# EAGLE design Attenuation (EAGLE 9.6.2)
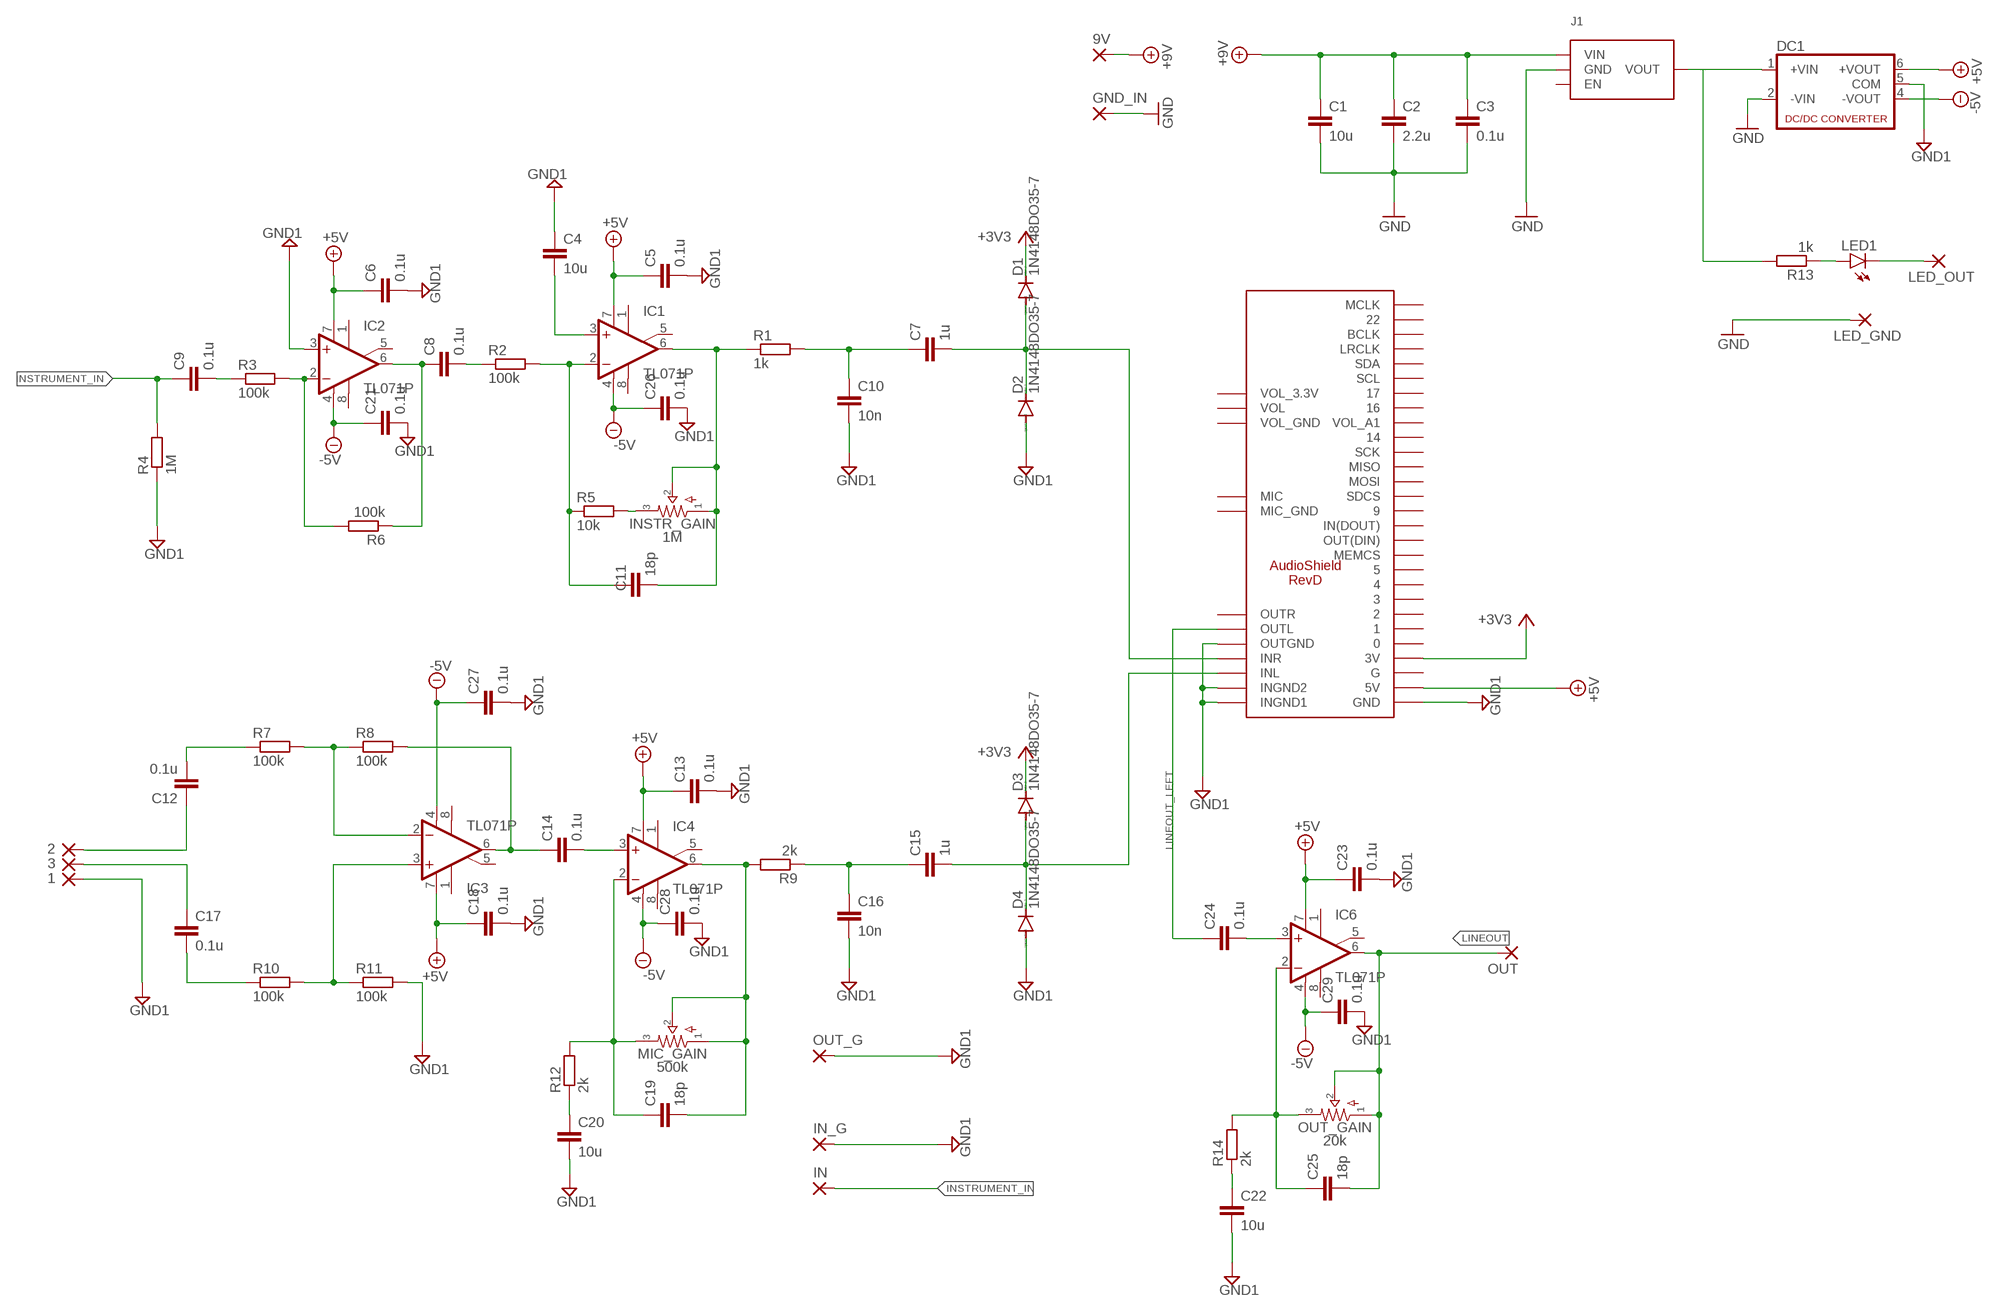
[diagram p0: schematic, sheet 1]

## Parts
1  1,6/0,8  [1,6/0,8]
2  1,6/0,8  [1,6/0,8]
3  1,6/0,8  [1,6/0,8]
9V  1,6/0,8  [1,6/0,8]
C1  10u  C5/2.5  [C5B2.5]
C2  2.2u  C5/2.5  [C5B2.5]
C3  0.1u  C-EUC0805  [C0805]
C4  10u  C5/2.5  [C5B2.5]
C5  0.1u  C-EUC0805  [C0805]
C6  0.1u  C-EUC0805  [C0805]
C7  1u  C-EUC0805  [C0805]
C8  0.1u  C-EUC0805  [C0805]
C9  0.1u  C-EUC0805  [C0805]
C10  10n  C-EUC0805  [C0805]
C11  18p  C-EUC0805  [C0805]
C12  0.1u  C-EUC0805  [C0805]
C13  0.1u  C-EUC0805  [C0805]
C14  0.1u  C-EUC0805  [C0805]
C15  1u  C-EUC0805  [C0805]
C16  10n  C-EUC0805  [C0805]
C17  0.1u  C-EUC0805  [C0805]
C18  0.1u  C-EUC0805  [C0805]
C19  18p  C-EUC0805  [C0805]
C20  10u  C5/2.5  [C5B2.5]
C21  0.1u  C-EUC0805  [C0805]
C22  10u  C5/2.5  [C5B2.5]
C23  0.1u  C-EUC0805  [C0805]
C24  0.1u  C-EUC0805  [C0805]
C25  18p  C-EUC0805  [C0805]
C26  0.1u  C-EUC0805  [C0805]
C27  0.1u  C-EUC0805  [C0805]
C28  0.1u  C-EUC0805  [C0805]
C29  0.1u  C-EUC0805  [C0805]
D1  1N4148DO35-7  [DO35-7]
D2  1N4148DO35-7  [DO35-7]
D3  1N4148DO35-7  [DO35-7]
D4  1N4148DO35-7  [DO35-7]
DC1  NMA  [NMA]
GND_IN  1,6/0,8  [1,6/0,8]
IC1  TL071P  [DIL08]
IC2  TL071P  [DIL08]
IC3  TL071P  [DIL08]
IC4  TL071P  [DIL08]
IC6  TL071P  [DIL08]
IN  1,6/0,8  [1,6/0,8]
IN_G  1,6/0,8  [1,6/0,8]
INSTR_GAIN  1M  16MM.4  [16MM_PADS.1]
J1  DCDC_MINI_CONVERTER  [DCDC_MINI_CONVERTER]
LED1  LED5MM  [LED5MM]
LED_GND  1,6/0,8  [1,6/0,8]
LED_OUT  1,6/0,8  [1,6/0,8]
MIC_GAIN  500k  16MM.4  [16MM_PADS.1]
MOD1  AUDIOSHIELD-REVD  [AUDIOSHIELD-REVD]
OUT  1,6/0,8  [1,6/0,8]
OUT_G  1,6/0,8  [1,6/0,8]
OUT_GAIN  20k  16MM.4  [16MM_PADS.1]
R1  1k  R-EU_R0805  [R0805]
R2  100k  R-EU_R0805  [R0805]
R3  100k  R-EU_R0805  [R0805]
R4  1M  R-EU_R0805  [R0805]
R5  10k  R-EU_R0805  [R0805]
R6  100k  R-EU_R0805  [R0805]
R7  100k  R-EU_R0805  [R0805]
R8  100k  R-EU_R0805  [R0805]
R9  2k  R-EU_R0805  [R0805]
R10  100k  R-EU_R0805  [R0805]
R11  100k  R-EU_R0805  [R0805]
R12  2k  R-EU_R0805  [R0805]
R13  1k  R-EU_R0805  [R0805]
R14  2k  R-EU_R0805  [R0805]

## Nets
+3V3: D1.C D3.C MOD1.3V
+5V: C5.1 C6.1 C13.1 C18.1 C23.1 DC1.6(+VOUT) IC1.7(V+) IC2.7(V+) IC3.7(V+) IC4.7(V+) IC6.7(V+) MOD1.5V
+9V: 9V.1(P) C1.1 C2.1 C3.1 J1.VIN
-5V: C21.1 C26.1 C27.1 C28.1 C29.1 DC1.4(-VOUT) IC1.4(V-) IC2.4(V-) IC3.4(V-) IC4.4(V-) IC6.4(V-)
GND: C1.2 C2.2 C3.2 DC1.2(-VIN) GND_IN.1(P) J1.GND LED_GND.1(P)
GND1: 1.1(P) C4.1 C5.2 C6.2 C10.2 C13.2 C16.2 C18.2 C20.2 C21.2 C22.2 C23.2 C26.2 C27.2 C28.2 C29.2 D2.A D4.A DC1.5(COM) IC2.3(+IN) IN_G.1(P) MOD1.GND MOD1.INGND1 MOD1.INGND2 MOD1.OUTGND OUT_G.1(P) R4.1 R11.2
INSTRUMENT_IN: C9.1 IN.1(P) R4.2
LINEOUT: C25.2 IC6.6(OUT) OUT.1(P) OUT_GAIN.1 OUT_GAIN.2
LINEOUT_LEFT: C24.1 MOD1.OUTL
N$1: LED1.A R13.1
N$2: C11.1 IC1.2(-IN) R2.2 R5.1
N$3: C7.1 C10.1 R1.2
N$4: C4.2 IC1.3(+IN)
N$5: LED1.K(C) LED_OUT.1(P)
N$6: C11.2 IC1.6(OUT) INSTR_GAIN.1 INSTR_GAIN.2 R1.1
N$7: C7.2 D1.A D2.C MOD1.INR
N$8: 2.1(P) C12.1
N$9: C12.2 R7.1
N$10: DC1.1(+VIN) J1.VOUT R13.2
N$11: 3.1(P) C17.1
N$12: C17.2 R10.1
N$14: C14.1 IC3.6(OUT) R8.2
N$15: C25.1 IC6.2(-IN) OUT_GAIN.3 R14.2
N$16: C22.1 R14.1
N$18: C24.2 IC6.3(+IN)
N$20: C19.1 IC4.2(-IN) MIC_GAIN.3 R12.2
N$22: C20.1 R12.1
N$23: C19.2 IC4.6(OUT) MIC_GAIN.1 MIC_GAIN.2 R9.2
N$24: C15.1 C16.1 R9.1
N$25: C15.2 D3.A D4.C MOD1.INL
N$30: C8.1 IC2.6(OUT) R6.1
N$31: C9.2 R3.1
N$32: C8.2 R2.1
N$33: INSTR_GAIN.3 R5.2
N$34: IC2.2(-IN) R3.2 R6.2
N$35: IC3.3(+IN) R10.2 R11.1
N$36: IC3.2(-IN) R7.2 R8.1
N$38: C14.2 IC4.3(+IN)
Unconnected: IC1.1(ON1) IC1.5(ON2) IC1.8(OPT) IC2.1(ON1) IC2.5(ON2) IC2.8(OPT) IC3.1(ON1) IC3.5(ON2) IC3.8(OPT) IC4.1(ON1) IC4.5(ON2) IC4.8(OPT) IC6.1(ON1) IC6.5(ON2) IC6.8(OPT) J1.EN MOD1.0 MOD1.1 MOD1.2 MOD1.3 MOD1.4 MOD1.5 MOD1.6(MEMCS) MOD1.7(OUT(DIN)) MOD1.8(IN(DOUT)) MOD1.9 MOD1.10(SDCS) MOD1.11(MOSI) MOD1.12(MISO) MOD1.13(SCK) MOD1.14 MOD1.15(VOL_A1) MOD1.16 MOD1.17 MOD1.18(SDA) MOD1.19(SCL) MOD1.20(LRCLK) MOD1.21(BCLK) MOD1.22 MOD1.23(MCLK) MOD1.G MOD1.GND_MIC(MIC_GND) MOD1.MIC MOD1.OUTR MOD1.VOL MOD1.VOL_3.3V MOD1.VOL_GND

## Library data of the parts
1-3 9V GND_IN IN IN_G LED_GND LED_OUT OUT OUT_G = wirepad:1,6/0,8: THROUGH-HOLE PAD
C1 C2 C4 C20 C22 = capacitor-wima:C: CAPACITOR naming: grid - package width
C3 C5-C19 C21 C23-C29 = rcl:C-EU: CAPACITOR, European symbol; SPICEPREFIX: C
D1-D4 = diode:1N4148: DIODE high speed (Philips)
DC1 = dc-dc-converter:NMA: DC-DC CONVERTER; MF: C & D TECHNOLOGIES, INC; MPN: NMA0515SC; OC_FARNELL: 1021434; OC_NEWARK: 61K3064
IC1-IC4 IC6 = linear:TL071: OP AMP
INSTR_GAIN MIC_GAIN OUT_GAIN = potentiometers:16MM: 16mm Poteniometers
J1 = Joel Custom library:DCDC_MINI_CONVERTER: Mini DC-DC buck converter
LED1 = led:LED: LED OSRAM: - CHIPLED LG R971, LG N971, LY N971, LG Q971, LY Q971, LO R971, LY R971 LH N974, LH R974 LS Q976, LO Q976, LY Q976 LO Q996 - Hyper CHIPLED LW Q18S LB Q993, LB Q99A, LB R99A - SideLED LS A670, LO A670, LY A670, LG A670, LP A670 LB A673, LV A673, LT A673, LW A673 LH A674 LY A675 LS A676, LA A676, LO A676, LY A676, LW A676 LS A679, LY A679, LG A679 - Hyper Micro SIDELED® LS Y876, LA Y876, LO Y876, LY Y876 LT Y87S - SmartLED LW L88C, LW L88S LB L89C, LB L89S, LG L890 LS L89K, LO L89K, LY L89K LS L896, LA L896, LO L896, LY L896 - TOPLED LS T670, LO T670, LY T670, LG T670, LP T670 LSG T670, LSP T670, LSY T670, LOP T670, LYG T670 LG T671, LOG T671, LSG T671 LB T673, LV T673, LT T673, LW T673 LH T674 LS T676, LA T676, LO T676, LY T676, LB T676, LH T676, LSB T676, LW T676 LB T67C, LV T67C, LT T67C, LS T67K, LO T67K, LY T67K, LW E67C LS E67B, LA E67B, LO E67B, LY E67B, LB E67C, LV E67C, LT E67C LW T67C LS T679, LY T679, LG T679 LS T770, LO T770, LY T770, LG T770, LP T770 LB T773, LV T773, LT T773, LW T773 LH T774 LS E675, LA E675, LY E675, LS T675 LS T776, LA T776, LO T776, LY T776, LB T776 LHGB T686 LT T68C, LB T68C - Hyper Mini TOPLED® LB M676 - Mini TOPLED Santana® LG M470 LS M47K, LO M47K, LY M47K Source: http://www.osram.convergy.de LUXEON: - LUMILED® LXK2-PW12-R00, LXK2-PW12-S00, LXK2-PW14-U00, LXK2-PW14-V00 LXK2-PM12-R00, LXK2-PM12-S00, LXK2-PM14-U00 LXK2-PE12-Q00, LXK2-PE12-R00, LXK2-PE12-S00, LXK2-PE14-T00, LXK2-PE14-U00 LXK2-PB12-K00, LXK2-PB12-L00, LXK2-PB12-M00, LXK2-PB14-N00, LXK2-PB14-P00, LXK2-PB14-Q00 LXK2-PR12-L00, LXK2-PR12-M00, LXK2-PR14-Q00, LXK2-PR14-R00 LXK2-PD12-Q00, LXK2-PD12-R00, LXK2-PD12-S00 LXK2-PH12-R00, LXK2-PH12-S00 LXK2-PL12-P00, LXK2-PL12-Q00, LXK2-PL12-R00 Source: www.luxeon.com KINGBRIGHT: KA-3528ASYC Source: www.kingbright.com
MOD1 = Teensy_Audioshield:AUDIOSHIELD-REVD
R1-R14 = rcl:R-EU_: RESISTOR, European symbol; SPICEPREFIX: R

## Board
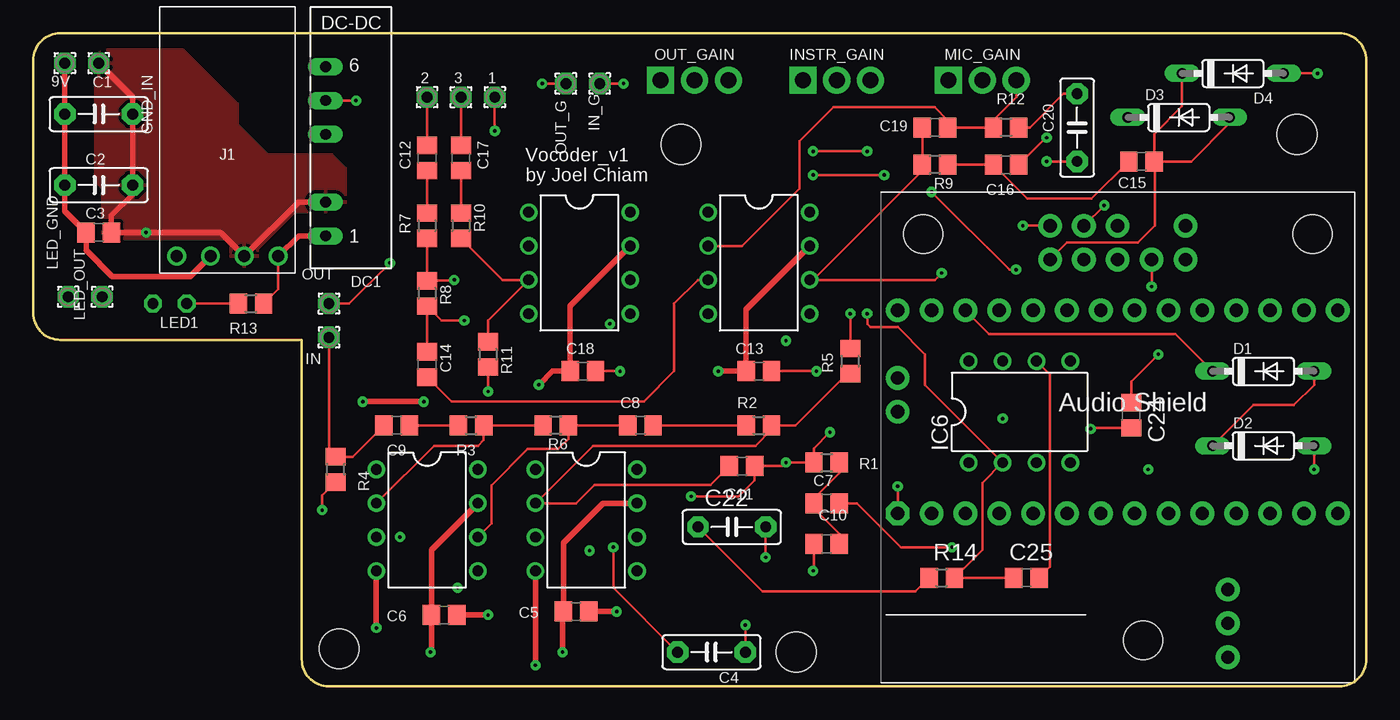
[diagram p1: board, top side]
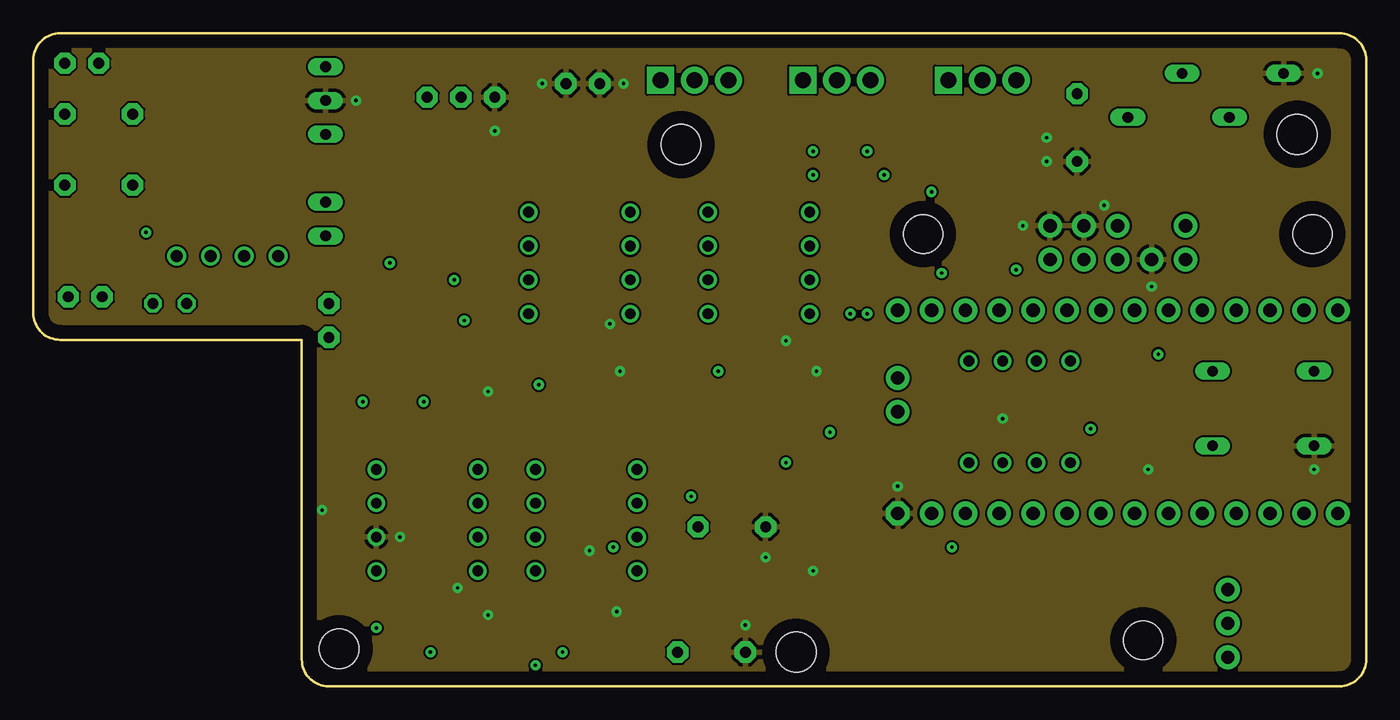
[diagram p2: board, inner layer GND]
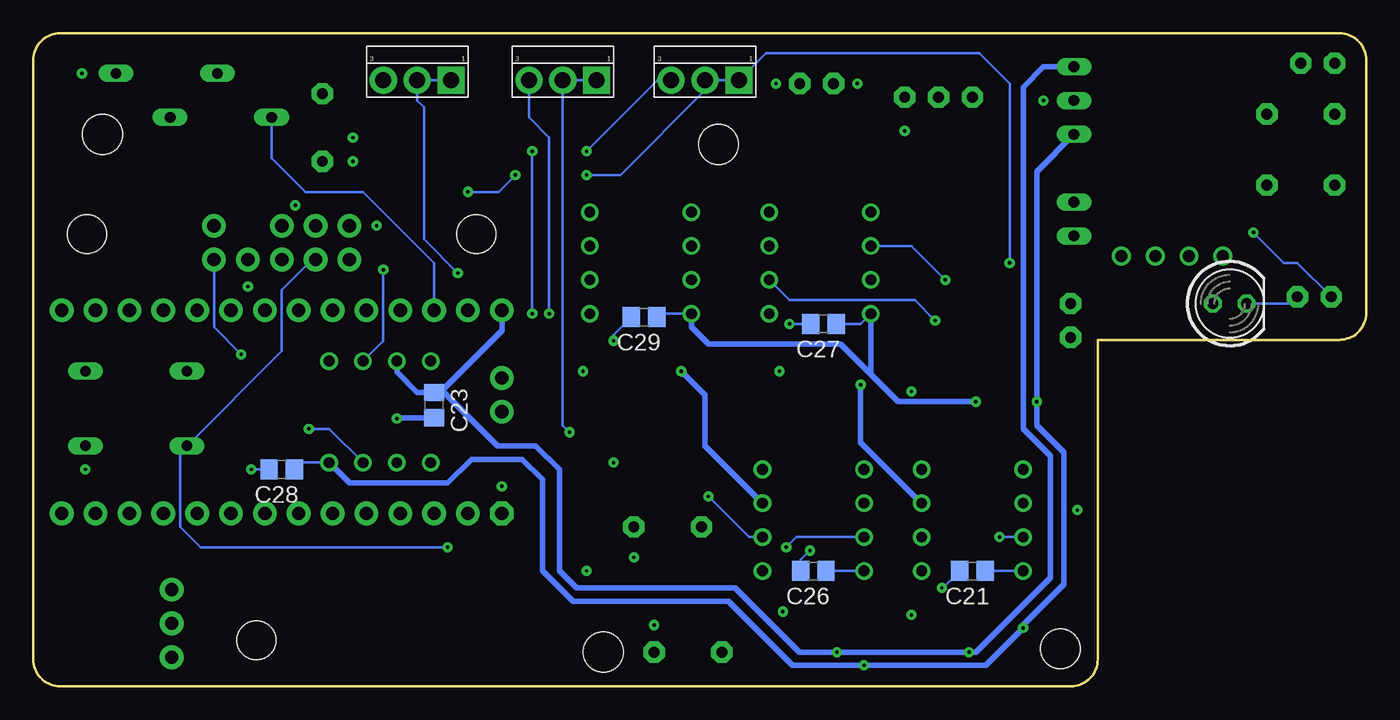
[diagram p3: board, bottom side, seen from below]

Size 100 x 49 mm. Coordinates in mm from the lower left corner, seen from the top.
Outline: 100,2 100,47 arc90 98,49 2,49 arc90 0,47 0,28 arc90 2,26 20.15,26 20.15,2 arc90 22.15,0 98,0 arc90 100,2
Copper layers (1+2*15+16): Top 0.035mm / dielectric 0.11mm / GND 0.035mm / dielectric 1.2mm / Trace2 0.035mm / dielectric 0.11mm / Bottom 0.035mm
Design rules "default *": minimum track width 6mil, minimum drill 0.25mm, track to track 6mil, track to pad 6mil, pad to pad 6mil, via to via 6mil, smd to smd 6mil, copper to edge 40mil, drill to drill 6mil, minimum pad ring 10mil, minimum via ring 10mil, stop-mask expansion 4mil, vias tented up to drill 0mil, thermal gap 10mil
Holes 3 mm at 48.59,40.66 22.94,2.81 57.23,2.56 94.82,41.42

### Footprints (pad centres in the part's own frame; a part is rotated, then mirrored left to right if it is on the bottom)
1,6/0,8 = drill 0.813 pad 1.6 octagon: 1 0,0
C5B2.5 = drill 0.813 pad 1.6 octagon: 1 -2.54,0; 2 2.54,0
C0805 = smd 1.3 x 1.5: 1 -0.95,0; 2 0.95,0
DO35-7 = drill 0.813 long: A 3.81,0; C -3.81,0
NMA = drill 0.813 long: 1 0,6.35; 2 0,3.81; 4 0,-1.27; 5 0,-3.81; 6 0,-6.35
DIL08 = drill 0.813 pad 1.27: 1 -3.81,-3.81; 2 -1.27,-3.81; 3 1.27,-3.81; 4 3.81,-3.81; 5 3.81,3.81; 6 1.27,3.81; 7 -1.27,3.81; 8 -3.81,3.81
16MM_PADS.1 = drill 1.2 pad 2.032 square: 1 2.54,0 | drill 1.2 pad 2.032: 2 0,0; 3 -2.54,0
DCDC_MINI_CONVERTER = drill 0.9: EN 3.81,0; GND -1.27,0; VIN 1.27,0; VOUT -3.81,0
LED5MM = drill 0.813 octagon: A -1.27,0; K 1.27,0
AUDIOSHIELD-REVD = drill 1 pad 1.778: 0 -13.97,-5.08; 1 -11.43,-5.08; 2 -8.89,-5.08; 3 -6.35,-5.08; 3V -11.43,10.16; 4 -3.81,-5.08; 5 -1.27,-5.08; 5V -16.51,10.16; 6 1.27,-5.08; 7 3.81,-5.08; 8 6.35,-5.08; 9 8.89,-5.08; 10 11.43,-5.08; 11 13.97,-5.08; 12 16.51,-5.08; 13 16.51,10.16; 14 13.97,10.16; 15 11.43,10.16; 16 8.89,10.16; 17 6.35,10.16; 18 3.81,10.16; 19 1.27,10.16; 20 -1.27,10.16; 21 -3.81,10.16; 22 -6.35,10.16; 23 -8.89,10.16; G -13.97,10.16; GND_MIC -16.51,2.54; INGND1 -5.08,16.51; INGND2 -2.54,16.51; INL -5.08,13.97; INR -2.54,13.97; MIC -16.51,5.08; OUTGND 2.54,13.97; OUTL 5.08,13.97; OUTR 0,13.97; UNUSED1 0,16.51; UNUSED2 5.08,16.51; VOL 8.255,-13.335; VOL_3.3V 8.255,-15.875; VOL_GND 8.255,-10.795 | drill 1 pad 1.778 octagon: GND -16.51,-5.08 | hole 2.921: 1.905,-14.605; -14.605,15.875; 14.605,15.875
R0805 = smd 1.3 x 1.5: 1 -0.95,0; 2 0.95,0

### Placement (x,y rotation side)
1  34.62,44.21 0 top
2  29.54,44.21 0 top
3  32.08,44.21 180 top
9V  2.37,46.75 0 top
C1  4.91,42.94 0 top
C2  4.91,37.61 0 top
C3  4.91,34.05 0 top
C4  50.88,2.56 180 top
C5  40.72,5.6 0 top
C6  30.81,5.35 0 top
C7  59.52,13.73 0 top
C8  45.55,19.57 0 top
C9  27.26,19.57 0 top
C10  59.52,10.68 180 top
C11  53.17,16.53 0 top
C12  29.54,39.64 270 top
C13  54.44,23.64 0 top
C14  29.54,24.15 270 top
C15  83.14,39.39 0 top
C16  72.98,39.13 0 top
C17  32.08,39.64 270 top
C18  41.23,23.64 0 top
C19  67.64,41.93 180 top
C20  78.31,41.93 270 top
C21  29.54,8.65 180 bottom
C22  52.4,11.95 0 top
C23  69.93,21.1 270 bottom
C24  82.38,20.34 270 top
C25  74.5,8.14 0 top
C26  41.48,8.65 180 bottom
C27  40.72,27.19 180 bottom
C28  81.36,16.27 180 bottom
C29  54.18,27.7 180 bottom
D1  92.28,23.64 0 top
D2  92.28,18.05 0 top
D3  85.93,42.69 0 top
D4  90,45.99 0 top
DC1  21.92,40.15 180 top
GND_IN  4.91,46.75 0 top
IC1  41.48,12.46 270 top
IC2  29.54,12.46 270 top
IC3  40.97,31.77 270 top
IC4  54.44,31.77 270 top
IC6  73.99,20.59 0 top
IN  22.18,26.18 0 top
IN_G  42.5,45.23 270 top
INSTR_GAIN  60.28,45.48 0 bottom
J1  14.56,32.27 180 top
LED1  10.24,28.72 0 bottom
LED_GND  2.62,29.23 0 top
LED_OUT  5.16,29.23 0 top
MIC_GAIN  71.2,45.48 0 bottom
MOD1  81.36,18.05 0 top
OUT  22.18,28.72 90 top
OUT_G  39.96,45.23 270 top
OUT_GAIN  49.61,45.48 0 bottom
R1  59.52,16.78 0 top
R2  54.44,19.57 0 top
R3  32.85,19.57 0 top
R4  22.69,16.27 90 top
R5  61.29,24.4 90 top
R6  39.2,19.57 180 top
R7  29.54,34.56 270 top
R8  29.54,29.48 270 top
R9  67.64,39.13 180 top
R10  32.08,34.56 270 top
R11  34.12,24.91 270 top
R12  72.98,41.93 180 top
R13  16.34,28.72 0 top
R14  68.15,8.14 0 top

### Tracks (layer width: path | path; a pad name or v marks a point on that pad's centre or on a via)
+3V3
  Top 0.203: MOD1.3V 71.71,26.43 85.68,26.43 D1.C
  Bottom 0.203: MOD1.3V 69.93,31.77 75.26,37.1 79.58,37.1 82.12,39.64 D3.C
+5V  (via drill 0.25)
  Top 0.406: IC2.7 29.86,10.24 C6.1 29.86,2.62 v29.8,2.56 | v39.7,2.56 39.7,5.54 C5.1 39.77,10.75 42.75,13.73 IC1.7 | v37.93,22.62 38.94,23.64 C18.1 40.28,28.53 IC3.7 | IC4.7 53.49,28.28 C13.1 v51.39,23.64
  Bottom 0.406: DC1.6 24.21,46.5 25.73,44.97 25.73,19.32 23.7,17.29 23.7,8.14 29.29,2.56 v29.8,2.56 v39.7,2.56 42.52,2.56 47.35,7.38 59.26,7.38 60.53,8.65 60.53,16.27 62.31,18.05 65.17,18.05 69.17,22.05 C23.1 | IC2.7 37.93,18.3 v37.93,22.62 | IC1.7 49.61,18.05 49.61,21.86 v51.39,23.64 | C23.1 71.2,22.05 72.72,23.57 IC6.7 | C23.1 69.49,22.05 64.85,26.69 MOD1.5V
+9V
  Top 0.406: 9V.1 C1.1 C2.1 2.37,35.64 C3.1 3.96,32.72 5.92,30.75 11.76,30.75 J1.VIN
-5V  (via drill 0.25)
  Top 0.406: IC2.4 v25.73,4.37 | IC1.4 v37.67,1.58 | v24.72,21.35 v29.29,21.35
  Bottom 0.203: IC6.4 79.9,16.78 C28.1 | IC4.4 52.98,27.96 C29.1 | C27.1 37.93,27.19 IC3.4 | C26.1 IC1.4 | C21.1 IC2.4
  Bottom 0.406: DC1.4 24.72,38.62 v24.72,21.35 24.72,19.57 22.69,17.54 22.69,7.64 25.73,4.59 v25.73,4.37 28.53,1.58 v37.67,1.58 43.04,1.58 47.83,6.37 59.52,6.37 61.8,8.65 61.8,15.51 63.33,17.03 67.14,17.03 68.91,15.26 76.28,15.26 IC6.4 | v29.29,21.35 35.13,21.35 37.16,23.38 | 37.16,23.38 IC3.4 | IC4.4 50.63,26.94 49.36,25.67 39.45,25.67 37.16,23.38
GND  (via drill 0.25)
  Top 0.406: GND_IN.1 7.45,44.21 C1.2 C2.2 7.45,36.91 5.86,35.32 C3.2 v8.46,34.05 14.05,34.05 J1.GND 19.89,36.34 DC1.2
  Bottom 0.203: LED_GND.1 5.16,31.77 6.18,31.77 v8.46,34.05
  pour Top: 5.16,33.8 5.41,33.54 14.3,33.54 14.81,33.04 14.81,31.77 15.07,31.51 16.59,31.51 16.84,31.77 16.84,32.78 19.64,35.58 22.94,35.58 23.45,36.08 23.45,38.88 22.43,39.89 17.61,39.89 15.32,42.18 15.32,43.7 11,48.02 5.41,48.02 4.65,47.26 4.65,37.86 5.16,37.35
GND1  (via drill 0.25)
  Top 0.203: DC1.5 v24.21,43.96 | MOD1.GND v64.85,15 | D2.A v96.09,16.27 | 1.1 v34.62,41.67 | OUT_G.1 v38.18,45.23 | R4.1 21.67,14.31 v21.67,13.22 | v44.02,23.64 C18.2 | R11.2 v34.12,22.11 | C13.2 v58.75,23.64 | D4.A v96.35,45.99 | v58.5,8.65 58.57,8.72 C10.2 | v76.03,41.16 75.96,41.16 C16.2 | C20.2 v76.03,39.39 | MOD1.OUTGND v83.9,29.99 | MOD1.INGND1 v74.25,34.56 | MOD1.INGND2 v80.34,36.08 | IN_G.1 v44.28,45.23 | C4.1 v53.42,4.59 | C22.2 v54.94,9.67
  Top 0.406: v34.12,5.35 C6.2 | C5.2 v43.77,5.6
  Bottom 0.203: IC2.3 v27.51,11.19 | C28.2 v83.65,16.27 | C21.2 31.76,7.38 v31.83,7.38 | C26.2 42.43,9.48 v41.74,10.18 | C27.2 v43.26,27.19 | C29.2 56.47,26.37 v56.47,25.92
  Bottom 0.406: C23.2 72.66,20.15 v72.72,20.08
  pour GND: -0.43,49.8 -0.43,-1.76 100.66,-1.76 100.66,49.8
INSTRUMENT_IN
  Top 0.203: IN.1 22.18,17.73 R4.2 23.96,17.22 C9.1
LINEOUT  (via drill 0.25)
  Top 0.203: IC6.6 76.28,23.38 76.28,8.97 C25.2 | v26.75,31.77 23.7,28.72 OUT.1 | v73.74,31.26 73.23,31.26 v67.39,37.1 | v63.83,38.37 v58.5,38.37
  Bottom 0.203: IC6.6 73.74,25.92 v73.74,31.26 | v26.75,31.77 26.75,45.23 29.04,47.51 45.04,47.51 OUT_GAIN.1 OUT_GAIN.2 49.61,44.72 55.96,38.37 v58.5,38.37 | v67.39,37.1 65.1,37.1 v63.83,38.37
LINEOUT_LEFT  (via drill 0.25)
  Top 0.203: C24.1 82.38,22.88 v84.41,24.91
  Bottom 0.203: v84.41,24.91 86.44,26.94 MOD1.OUTL
N$1
  Top 0.203: R13.1 LED1.A
N$2
  Top 0.203: R5.1 61.04,23.45 57.16,19.57 R2.2 55.39,19.25 54.18,18.05 41.99,18.05 IC1.2 40.72,13.73 42.09,15.1 50.79,15.1 C11.1
N$3
  Top 0.203: C10.1 60.47,11.45 58.57,13.35 C7.1 58.37,13.93 60.47,16.02 R1.2
N$4  (via drill 0.25)
  Top 0.203: C4.2 43.51,7.38 v43.51,10.43
  Bottom 0.203: v43.51,10.43 42.75,11.19 IC1.3
N$5
  Bottom 0.203: LED_OUT.1 5.67,28.72 LED1.K
N$6  (via drill 0.25)
  Top 0.203: v59.77,19.07 58.57,17.86 R1.1 v56.47,16.78 56.21,16.53 C11.2 54.12,15.44 52.91,14.24 v49.36,14.24
  Bottom 0.203: v59.77,19.07 60.28,19.57 INSTR_GAIN.2 INSTR_GAIN.1 | v49.36,14.24 46.31,11.19 IC1.6
N$7  (via drill 0.25)
  Top 0.203: D2.C 91.52,21.1 94.57,21.1 96.09,22.62 D1.A | C7.2 61.8,13.73 65.1,10.43 v68.91,10.43
  Bottom 0.203: MOD1.INR 79.07,32.02 81.36,29.73 81.36,25.16 D2.C 88.98,17.54 88.98,11.95 87.46,10.43 v68.91,10.43
N$8
  Top 0.203: 2.1 C12.1
N$9
  Top 0.203: C12.2 R7.1
N$10
  Top 0.203: R13.2 18.37,29.8 J1.VOUT
  Top 0.406: J1.VOUT 19.89,33.8 DC1.1
N$11
  Top 0.203: 3.1 C17.1
N$12
  Top 0.203: C17.2 R10.1
N$14  (via drill 0.25)
  Top 0.203: C14.1 R8.2 30.63,27.45 v32.34,27.45
  Bottom 0.203: IC3.6 43.26,28.97 33.86,28.97 v32.34,27.45
N$15  (via drill 0.25)
  Top 0.203: C25.1 R14.2 71.2,10.24 71.2,15.26 IC6.2 66.88,22.62 66.88,24.91 64.85,26.94 62.82,26.94 62.56,27.19 v62.56,27.96 | v62.56,40.15 v58.5,40.15
  Bottom 0.203: v62.56,27.96 v62.56,40.15 | v58.5,40.15 53.17,45.48 OUT_GAIN.3
N$16
  Top 0.203: R14.1 66.19,7.13 54.69,7.13 C22.1
N$18  (via drill 0.25)
  Top 0.203: v79.33,19.32 79.39,19.39 C24.2
  Bottom 0.203: IC6.3 77.8,19.32 v79.33,19.32
N$20
  Top 0.203: IC4.2 53.17,33.04 57.48,37.35 57.48,40.91 60.02,43.45 67.64,43.45 68.59,42.5 C19.1 R12.2 72.03,42.5 73.74,44.21 MIC_GAIN.3
N$22
  Top 0.203: R12.1 74.76,41.93 77.3,44.47 C20.1
N$23  (via drill 0.25)
  Top 0.203: v68.15,31 67.64,30.5 IC4.6 58.5,30.5 66.69,38.69 R9.2 C19.2
  Bottom 0.203: v68.15,31 70.69,33.54 70.69,43.45 71.2,43.96 MIC_GAIN.2 MIC_GAIN.1
N$24
  Top 0.203: R9.1 C16.1 74.57,36.59 79.39,36.59 C15.1
N$25
  Top 0.203: D3.A 89.74,42.25 86.88,39.39 84.15,39.39 | 84.15,39.39 C15.2 84.09,41.42 86.19,43.52 D4.C | MOD1.INL 77.55,33.29 82.88,33.29 84.15,34.56 84.15,39.39
N$30
  Top 0.203: C8.1 R6.1 40.15,18.56 39.38,17.8 37.1,17.8 34.37,15.07 34.37,12.21 IC2.6
N$31
  Top 0.203: R3.1 C9.2
N$32
  Top 0.203: R2.1 C8.2
N$33  (via drill 0.25)
  Top 0.203: R5.2 v61.29,27.96
  Bottom 0.203: v61.29,27.96 61.29,41.16 62.82,42.69 INSTR_GAIN.3
N$34
  Top 0.203: IC2.2 30.05,18.05 33.35,18.05 33.8,18.49 R3.2 R6.2
N$35
  Top 0.203: R11.1 34.12,27.45 IC3.3 35.2,30.5 R10.2
N$36  (via drill 0.25)
  Top 0.203: R7.2 R8.1 31.51,30.43 v31.58,30.5
  Bottom 0.203: IC3.2 34.12,33.04 v31.58,30.5
N$38
  Top 0.203: C14.2 31.39,21.35 45.8,21.35 48.09,23.64 48.09,28.72 49.86,30.5 IC4.3

### Text on the board
tPlace: Vocoder_v1 / by Joel Chiam